# EAGLE design SDuino_ultramicroOLED_radio4 (EAGLE 7.6.0)
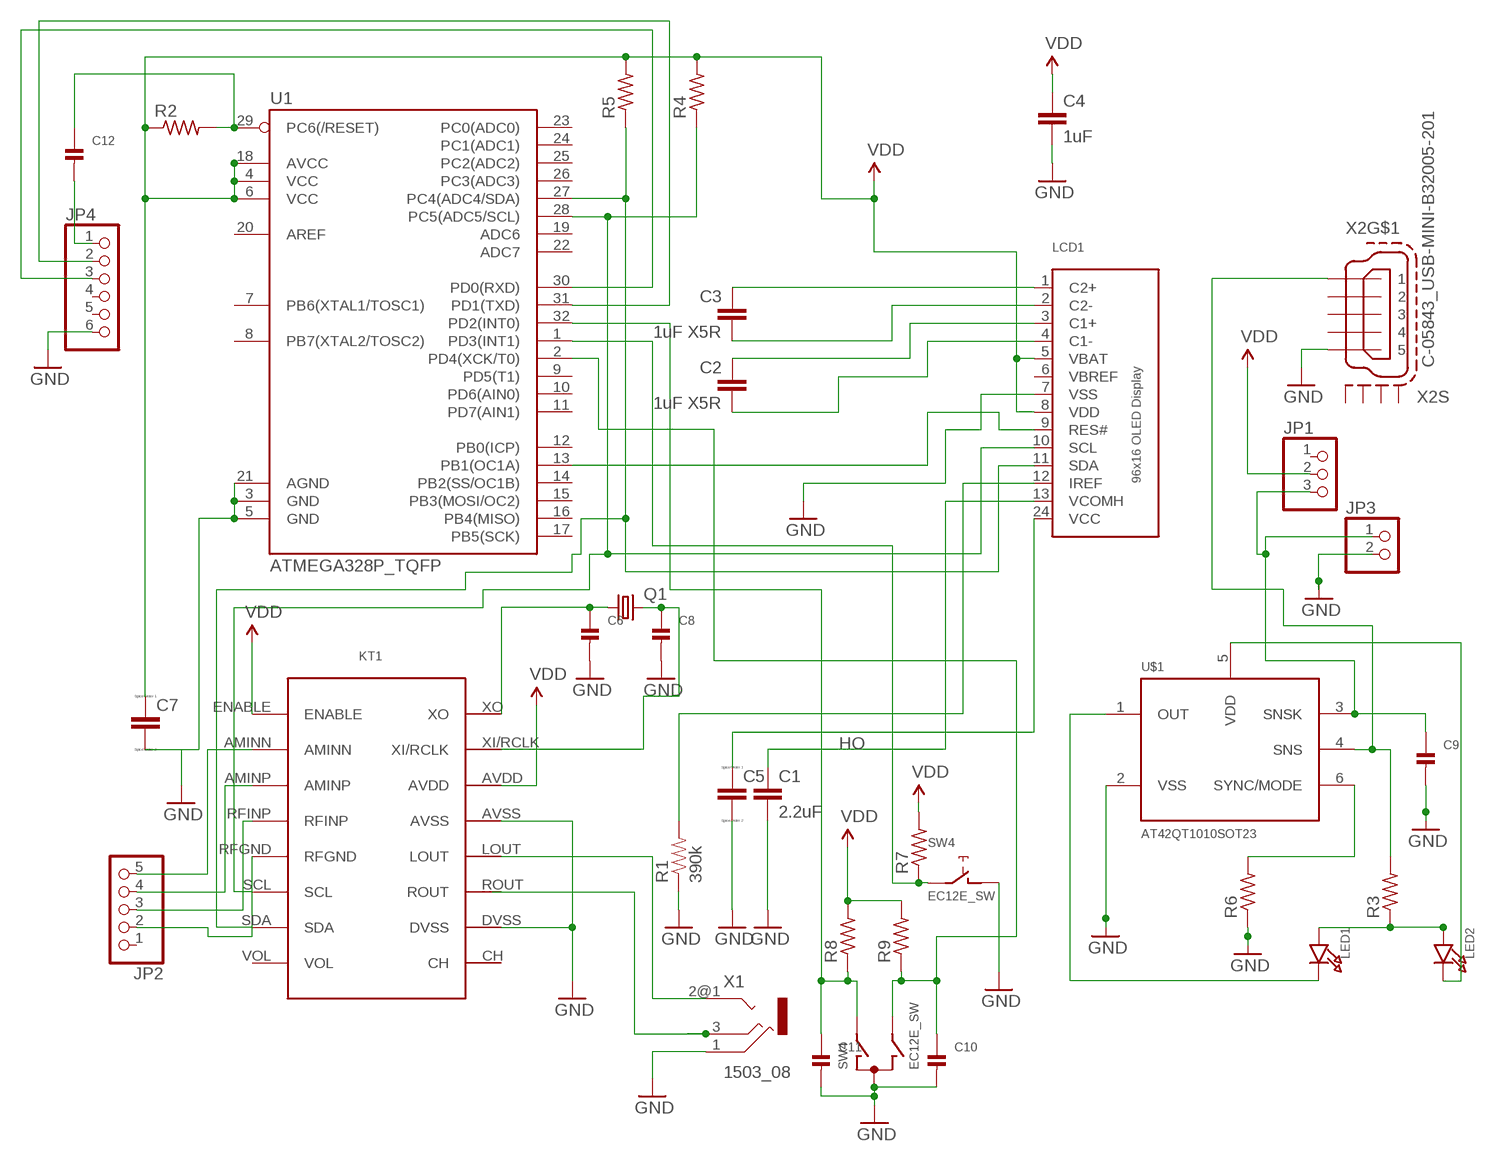
[diagram p0: schematic, sheet 1]

## Parts
C1  2.2uF  CAP0805  [0805]
C2  1uF X5R  CAP0805  [0805]
C3  1uF X5R  CAP0805  [0805]
C4  1uF  CAP0603-CAP  [0603-CAP]
C5  CC0603  [C0603]
C6  CAP_CERAMIC0603  [0603]
C7  CC0603  [C0603]
C8  CAP_CERAMIC0603  [0603]
C9  CAP_CERAMIC0603  [0603]
C10  CAP_CERAMIC0603  [0603]
C11  CAP_CERAMIC0603  [0603]
C12  CAP_CERAMIC0603  [0603]
JP1  HEADER-1X3  [1X03_OVAL]
JP2  HEADER-1X5  [1X05_OVAL]
JP3  HEADER-1X2  [1X02_OVAL]
JP4  HEADER-1X6  [1X06_OVAL]
KT1  KT0915  [KT0915]
LCD1  DISP_OLED_UG-9616GLBBG02  [UG-9616GLBBG02_0.65MM_WRAPAROUND]
LED1  LED0603  [CHIPLED_0603]
LED2  LED0603  [CHIPLED_0603]
Q1  CRYSTALTC26V  [TC26V]
R1  390k  RESISTOR0603-RES  [0603-RES]
R2  R-US_R0603  [R0603]
R3  R-US_R0603  [R0603]
R4  R-US_R0603  [R0603]
R5  R-US_R0603  [R0603]
R6  R-US_R0603  [R0603]
R7  R-US_R0603  [R0603]
R8  R-US_R0603  [R0603]
R9  R-US_R0603  [R0603]
SW4  EC12E_SW  [ALPS_EC12E_SW]
U1  ATMEGA328P_TQFP  [TQFP32-08]
U$1  AT42QT1010SOT23  [SOT23-6]
X1  1503_08  [1503_08]
X2  C-05843_USB-MINI-B32005-201  [32005-201]

## Nets
C1N: C2.2 LCD1.4(C1-)
C1P: C2.1 LCD1.3(C1+)
C2N: C3.2 LCD1.2(C2-)
C2P: C3.1 LCD1.1(C2+)
GND: C1.2 C4.2 C5.2 C6.2 C7.2 C8.2 C9.2 C10.2 C11.2 JP3.2 JP4.6 KT1.AVSS KT1.DVSS LCD1.7(VSS) R1.1 R6.1 SW4.C SW4.D U1.3(GND) U1.5(GND) U1.21(AGND) U$1.2(VSS) X1.1 X2.5
HO: C1.1 LCD1.13(VCOMH)
IREF: LCD1.12(IREF) R1.2
N$1: KT1.LOUT X1.2@1
N$2: C12.1 R2.2 U1.29(PC6(/RESET))
N$3: LCD1.9(RES#) U1.13(PB1(OC1A))
N$4: C6.1 KT1.XO Q1.1
N$5: C8.1 KT1.XI/RCLK Q1.2
N$6: KT1.SCL LCD1.10(SCL) R4.1 U1.28(PC5(ADC5/SCL))
N$7: KT1.ROUT X1.3
N$8: R3.2 U$1.4(SNS) X2.1
N$9: JP2.5 KT1.AMINN
N$10: KT1.SDA LCD1.11(SDA) R5.1 U1.27(PC4(ADC4/SDA))
N$11: JP2.4 KT1.AMINP
N$12: JP2.3 KT1.RFINP
N$13: JP2.2 KT1.RFGND
N$14: JP4.3 U1.30(PD0(RXD))
N$15: C11.1 R8.1 SW4.A U1.32(PD2(INT0))
N$16: C10.1 R9.1 SW4.B U1.2(PD4(XCK/T0))
N$17: LED1.A LED2.A R3.1
N$18: LED1.C U$1.1(OUT)
N$19: LED2.C U$1.5(VDD)
N$20: C9.1 JP1.3 JP3.1 U$1.3(SNSK)
N$21: R7.1 SW4.E U1.1(PD3(INT1))
N$22: R6.2 U$1.6(SYNC/MODE)
N$23: C12.2 JP4.1
N$24: JP4.2 U1.31(PD1(TXD))
VCOMH: C5.1 LCD1.24(VCC)
VDD: C4.1 C7.1 JP1.2 KT1.AVDD KT1.ENABLE LCD1.5(VBAT) LCD1.8(VDD) R2.1 R4.2 R5.2 R7.2 R8.2 R9.2 U1.4(VCC) U1.6(VCC) U1.18(AVCC)
Unconnected: JP1.1 JP2.1 JP4.4 JP4.5 KT1.CH KT1.VOL LCD1.6(VBREF) SW4.GND1(G) SW4.GND2(G) U1.7(PB6(XTAL1/TOSC1)) U1.8(PB7(XTAL2/TOSC2)) U1.9(PD5(T1)) U1.10(PD6(AIN0)) U1.11(PD7(AIN1)) U1.12(PB0(ICP)) U1.14(PB2(SS/OC1B)) U1.15(PB3(MOSI/OC2)) U1.16(PB4(MISO)) U1.17(PB5(SCK)) U1.19(ADC6) U1.20(AREF) U1.22(ADC7) U1.23(PC0(ADC0)) U1.24(PC1(ADC1)) U1.25(PC2(ADC2)) U1.26(PC3(ADC3)) X1.2@2 X2.2 X2.3 X2.4 X2.M1(S:S1) X2.M2(S:S2) X2.M3(S:S3) X2.M4(S:S4)

## Library data of the parts
C1-C4 = SparkFun-Passives:CAP: Capacitor Standard 0603 ceramic capacitor, and 0.1" leaded capacitor.
C5 C7 = eagle-ltspice:C: CAPACITOR, European symbol; SPICEMODEL: NONE; SPICEPREFIX: C
C6 C8-C12 = OLED_mod:CAP_CERAMIC: Ceramic Capacitors 0402 - 0402 Surface Mount Capacitors 16pF 50V 5% [Digikey: 445-4899-2-ND] 18pF 50V 5% [Digikey: 490-1281-2-ND] 22pF 50V 5% [Digikey: 490-1283-2-ND] 68pF 50V 5% [Digikey: 490-1289-2-ND] 0.1uF 10V 10% [Digikey: 490-1318-2-ND] 1.0uF 6.3V 10% [Digikey: 490-1320-2-ND] 0603 - 0603 Surface Mount Capacitors 16 pF 50V 5% [Digikey: 445-5051-2-ND] 22 pF 50V [Digikey: PCC220ACVTR-ND] 33 pF 50V 5% [Digikey: 490-1415-1-ND] 56pF 50V 5% [Digikey: 490-1421-1-ND] 220pF 50V 5% [Digikey: 445-1285-1-ND] 680 pF 50V 2200 pF 50V 5% C0G [Digikey: 445-1297-1-ND] 5600 pF 100V 5% X7R [Digikey: 478-3711-1-ND] 0.1 µF 25V 10% [Digikey: PCC2277TR-ND] 0.22 µF 16V 10% X7R [Digikey: 445-1318-1-ND] 1.0 µF 25V 10% [Digikey: 445-5146-2-ND] 0603 - RF Specific 3pF 250V +/-0.1pF RF [Digikey: 712-1347-1-ND] 18 pF 250V 5% [Digikey: 478-3505-1-ND or 712-1322-1-ND] 56 pF 250V 5% C0G RF [Digikey: 490-4867-1-ND] 68 pF 250V RF [Digikey: 490-4868-1-ND] 0805 - 0805 Surface Mount Capacitors 220 pF 250V 2% RF Ceramic Capacitor [Digikey: 712-1398-1-ND] 1000 pF 50V 2% NP0 Ceramic Capacitor [Digikey: 478-3760-1-ND] 0.1 µF 25V 10% Ceramic Capacitor [Digikey: PCC1828TR-ND] 1.0 µF 16V 10% Ceramic Capacitor[Digikey: 490-1691-2-ND] 10.0 µF 10V 10% Ceramic Capacitor[Digikey: 709-1228-1-ND] 10.0 uF 16V 10% Ceramic Capacitor [Digikey: 478-5165-2-ND] 47 uF 6.3V 20% Ceramic Capacitor [Digikey: 587-1779-1-ND or 399-5506-1-ND] 1206 - 1206 Surface Mount Capacitors 47uF 10V 20% Ceramic Capacitor [Digikey: 490-5528-1-ND or 399-5508-1-ND or 445-6010-1-ND] 100uF 6.3V -20%, +80% Y5V Ceramic Capacitor (Digikey: 490-4512-1-ND, Mouser: 81-GRM31CF50J107ZE1L)
JP1 = OLED_mod:HEADER-1X3: PIN HEADER
JP2 = OLED_mod:HEADER-1X5: PIN HEADER
JP3 = OLED_mod:HEADER-1X2: PIN HEADER
JP4 = OLED_mod:HEADER-1X6: PIN HEADER
KT1 = dp_devices:KT0915
LCD1 = OLED_mod:DISP_OLED_UG-9616GLBBG02: 96x16 0.84" I2C Mono OLED Display
LED1 LED2 = OLED_mod:LED: LED 0603 - 0603 Surface Mount Package 2mA: Green LED - Low Power (3.9mcd, 2ma, 1.7Vf) - Digikey: 475-2709-2-ND Orange LED - Low Power (9.8mcd, 2ma, 1.8Vf) - Digikey: 475-1194-2-ND Red LED - Low Power (5mcd, 2ma, 1.8Vf) - Digikey: 475-1195-2-ND Yellow LED - Low Power (7mcd, 2ma, 1.8Vf) - Digikey: 475-1196-2-ND 5mA: Blue LED - Low Power (17mcd, 5ma, 2.9Vf) - Digikey: LNJ937W8CRACT-ND 0805 - 0805 Surface Mount Package 2mA: Red LED (8.8mcd, 2mA, 1.8Vf, Clear) - Low Power [Digikey: 475-2510-1-ND] Green LED (5mcd, 2mA, 1.8Vf, Clear) - Low Power [Digikey: 475-2730-1-ND] Yellow LED (11.3mcd, 2mA, 1.8Vf, Clear) - Low Power [Digikey: 475-2555-1-ND] 20mA: Red LED (104mcd, 20mA, Diffused) - LS R976 [Digikey: 475-1278-6-ND] Red LED (12mcd, 20mA, 2.0Vf, Clear) - APT2012EC [Digikey: 754-1128-1-ND] Green LED (15mcd, 20mA, 2.2Vf, Clear) - APT2012GC [Digikey: 754-1131-1-ND] Orange LED (160mcd, 20mA, 2.1Vf, Clear) - APT2012SECK [Digikey: 754-1130-1-ND] 1206 - 1206 Surface Mount Package Green LED (26mcd, 20mA, Diffused) - LG N971 [Digikey: 475-1407-6-ND] Red LED (15mcd, 20mA, Diffused) - LH N974 [Digikey: 475-1416-6-ND]
Q1 = adafruit:CRYSTAL: CRYSTAL; OC_FARNELL: unknown; OC_NEWARK: unknown
R1 = SparkFun-Passives:RESISTOR: Resistor Basic schematic elements and footprints for 0603, 1206, and PTH resistors.
R2-R9 = resistor:R-US_: RESISTOR, American symbol
SW4 = switch-alps:EC12E_SW: ALPS rotary Encoder EC12E series with switch; MPN: EC12E2424407; OC_FARNELL: 1520813; OC_NEWARK: 74M1068
U1 = SparkFun-DigitalIC:ATMEGA328P_TQFP; PROD_ID: IC-09069
U$1 = SparkFun-DigitalIC:AT42QT1010
X1 = con-lumberg:1503_?: Jack connectors according to JISC 6560, 3.5 mm Klinkensteckverbinder nach JISC 6560, 3,5 mm Source: http://www.lumberg.com/Produkte/PDFs/1503_08.pdf; OC_FARNELL: unknown; OC_NEWARK: unknown
X2 = Akizuki:C-05843_USB-MINI-B: MINI USB-B Conector Source: www.cypressindustries.com; OC_FARNELL: unknown; OC_NEWARK: unknown

## Board
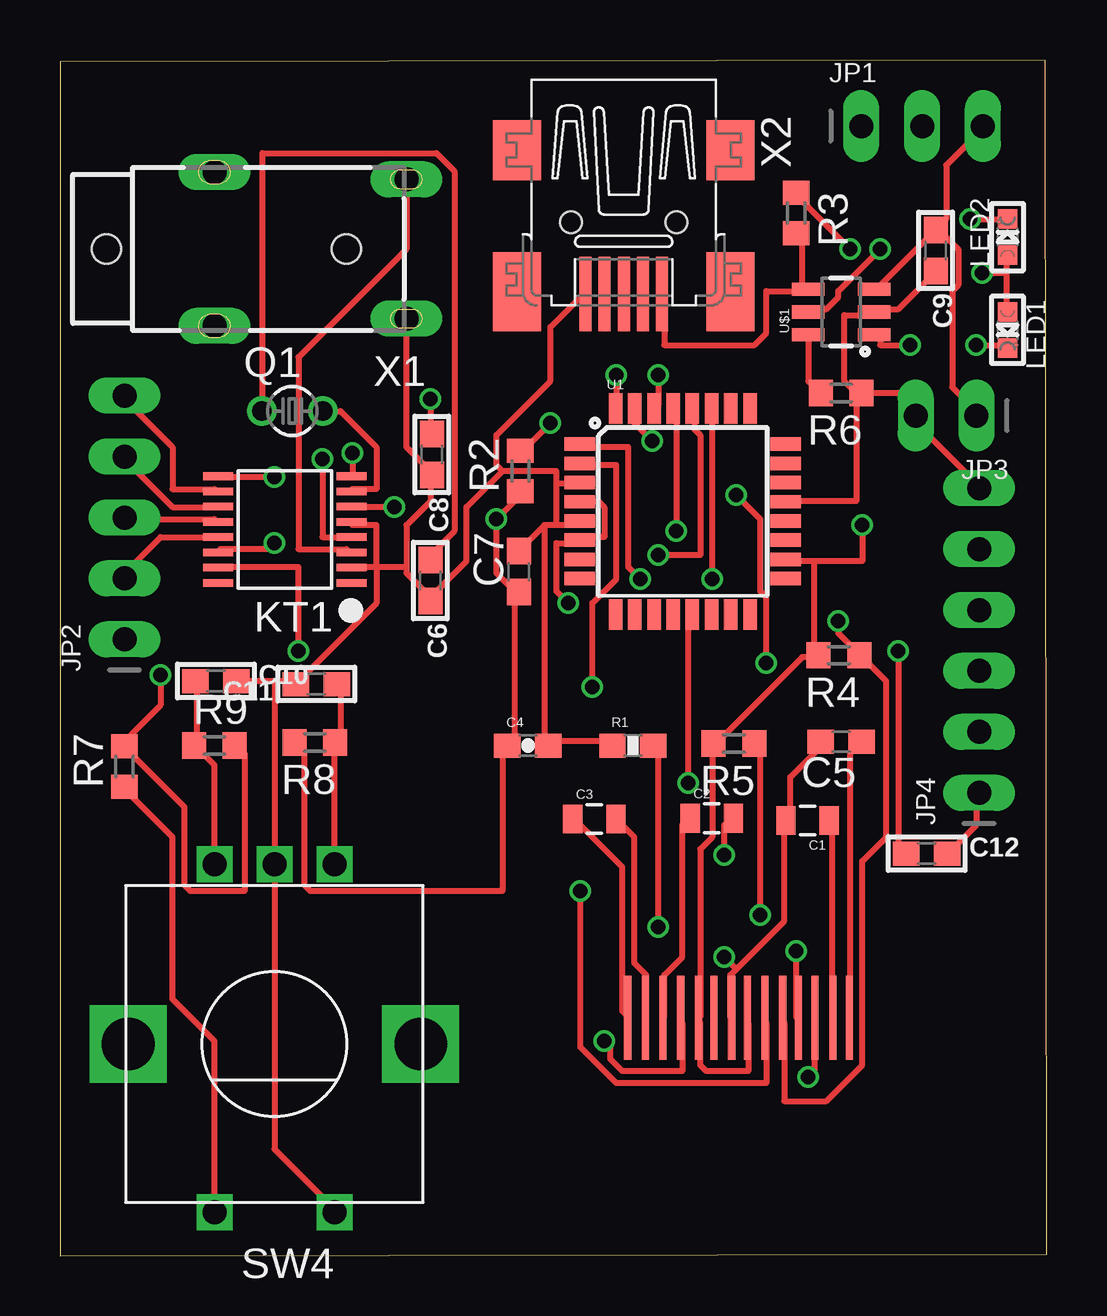
[diagram p1: board, top side]
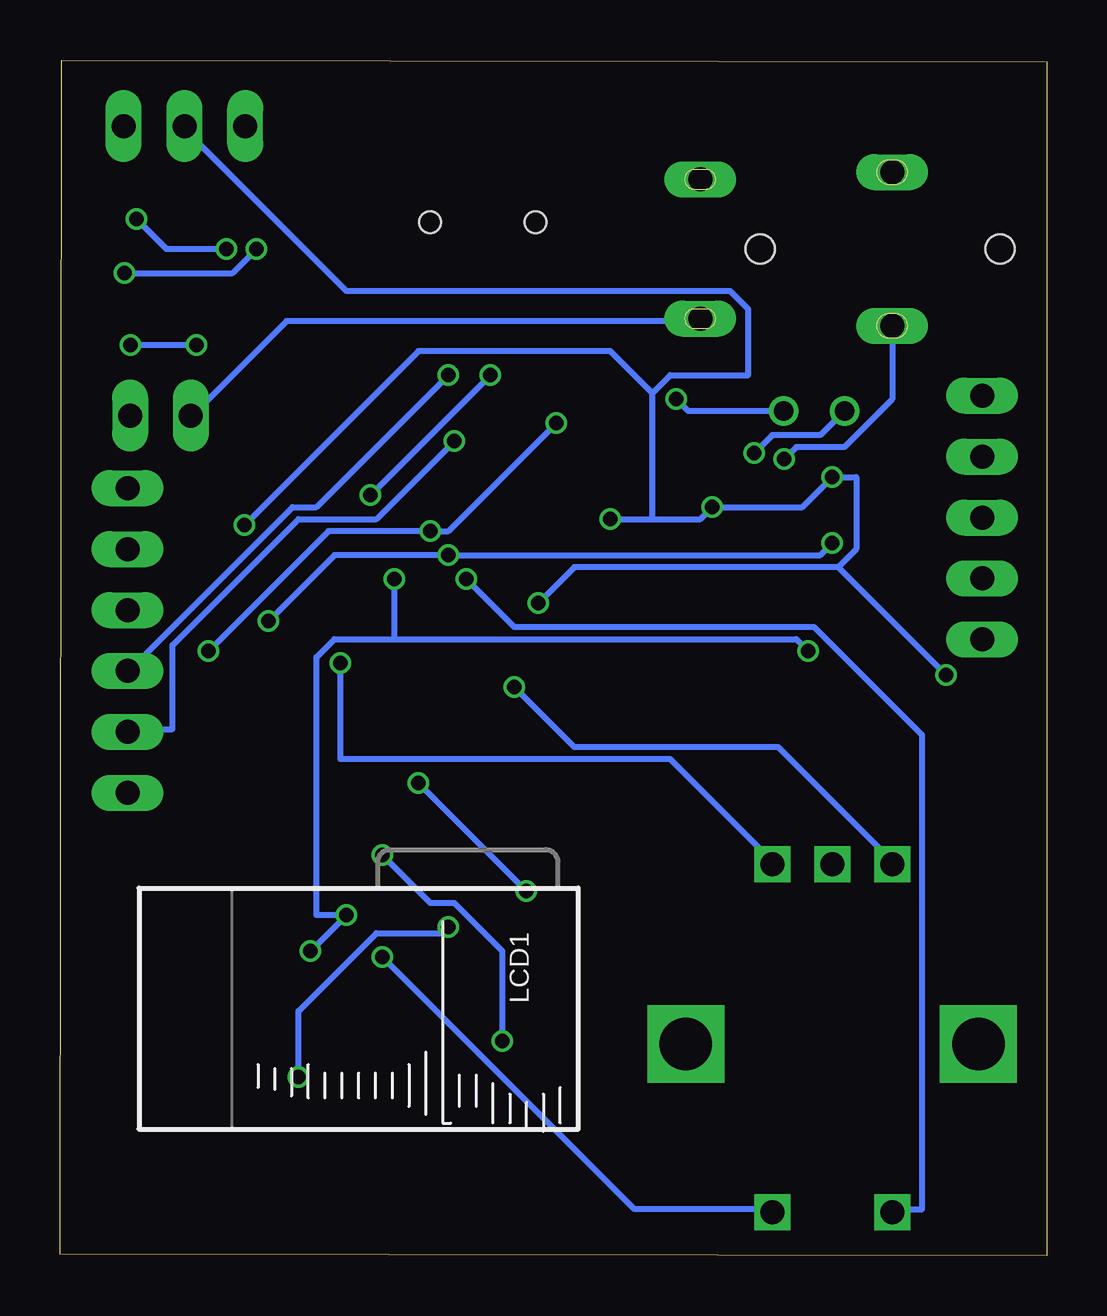
[diagram p2: board, bottom side, seen from below]

Size 41.12 x 49.81 mm. Coordinates in mm from the lower left corner, seen from the top.
Outline: 0,0 41.13,0.06 41.06,49.81 0,49.75 0,0
Copper layers (1*16): Top 0.035mm / dielectric 1.6mm / Bottom 0.035mm
Design rules "Elecrow_2-layer_PCB_eagle_rule": minimum track width 6mil, minimum drill 12mil, track to track 6mil, track to pad 6mil, pad to pad 6mil, via to via 8mil, smd to smd 0mil, copper to edge 20mil, drill to drill 10mil, minimum pad ring 6mil, minimum via ring 6mil, stop-mask expansion 0mil, vias tented up to drill 100mil, thermal gap 10mil

### Footprints (pad centres in the part's own frame; a part is rotated, then mirrored left to right if it is on the bottom)
0805 = smd 0.8 x 1.2: 1 -0.9,0; 2 0.9,0
0603-CAP = smd 1.1 x 1: 1 -0.85,0; 2 0.85,0
C0603 = smd 1.1 x 1: 1 -0.85,0; 2 0.85,0
0603 = smd 1.1 x 1: 1 -0.85,0; 2 0.85,0
1X03_OVAL = drill 1 long: 1 -2.54,0; 2 0,0; 3 2.54,0
1X05_OVAL = drill 1 long: 1 -5.08,0; 2 -2.54,0; 3 0,0; 4 2.54,0; 5 5.08,0
1X02_OVAL = drill 1 long: 1 -1.27,0; 2 1.27,0
1X06_OVAL = drill 1 long: 1 -6.35,0; 2 -3.81,0; 3 -1.27,0; 4 1.27,0; 5 3.81,0; 6 6.35,0
KT0915 = smd 0.32 x 1.26: AMINN 1.587,2.779; AMINP 0.952,2.779; AVDD 0.952,-2.779; AVSS 0.317,-2.779; CH -2.223,-2.779; DVSS -1.588,-2.779; ENABLE 2.222,2.779; LOUT -0.318,-2.779; RFGND -0.318,2.779; RFINP 0.317,2.779; ROUT -0.953,-2.779; SCL -0.953,2.779; SDA -1.588,2.779; VOL -2.223,2.779; XI/RCLK 1.587,-2.779; XO 2.222,-2.779
UG-9616GLBBG02_0.65MM_WRAPAROUND = smd 3.5 x 0.3 bottom: 1 -5.4,-0.463; 2 -5.4,0.275; 3 -5.4,1.012; 4 -5.4,1.75; 5 -5.4,2.487; 6 -5.4,3.138; 7 -5.4,3.875; 8 -5.4,4.525; 9 -5.4,5.263; 10 -5.4,6; 11 -5.4,6.65; 12 -5.4,7.338; 13 -5.4,8.088; 24 -5.4,8.775
CHIPLED_0603 = smd 0.8 x 0.8: A 0,-0.75; C 0,0.75
TC26V = drill 0.813: 1 -1.27,0; 2 1.27,0
0603-RES = smd 1.1 x 1: 1 -0.85,0; 2 0.85,0
R0603 = smd 1 x 1.1: 1 -0.85,0; 2 0.85,0
ALPS_EC12E_SW = drill 1 square: A -2.5,-7.5; B 2.5,-7.5; C 0,-7.5; D -2.5,7; E 2.5,7 | drill 2.2 square: GND1 -6.1,0; GND2 6.1,0
TQFP32-08 = smd 1.27 x 0.559: 1 -4.293,2.8; 2 -4.293,2; 3 -4.293,1.2; 4 -4.293,0.4; 5 -4.293,-0.4; 6 -4.293,-1.2; 7 -4.293,-2; 8 -4.293,-2.8; 17 4.293,-2.8; 18 4.293,-2; 19 4.293,-1.2; 20 4.293,-0.4; 21 4.293,0.4; 22 4.293,1.2; 23 4.293,2; 24 4.293,2.8 | smd 0.559 x 1.27: 9 -2.8,-4.293; 10 -2,-4.293; 11 -1.2,-4.293; 12 -0.4,-4.293; 13 0.4,-4.293; 14 1.2,-4.293; 15 2,-4.293; 16 2.8,-4.293; 25 2.8,4.293; 26 2,4.293; 27 1.2,4.293; 28 0.4,4.293; 29 -0.4,4.293; 30 -1.2,4.293; 31 -2,4.293; 32 -2.8,4.293
SOT23-6 = smd 0.55 x 1.35: 1 -0.95,-1.375; 2 0,-1.375; 3 0.95,-1.375; 4 0.95,1.375; 5 0,1.375; 6 -0.95,1.375
1503_08 = drill 1 pad 1.2 long: 1 -2.9,-8; 2@1 -3.2,0; 2@2 3.2,0; 3 2.9,-8 | hole 1.2: 0,4.5; 0,-5.5
32005-201 = smd 3.1 x 0.5: 1 3,1.6; 2 3,0.8; 3 3,0; 4 3,-0.8; 5 3,-1.6 | smd 2.5 x 2: M1 -3,-4.45; M2 -3,4.45 | smd 3.3 x 2: M3 2.9,4.45; M4 2.9,-4.45 | hole 0.9: 0,2.2; 0,-2.2

### Placement (x,y rotation side)
C1  31.16,18.13 180 top
C2  27.17,18.21 0 top
C3  22.27,18.19 0 top
C4  19.5,21.25 0 top
C5  32.56,21.41 180 top
C6  15.44,28.12 270 top
C7  19.13,28.5 90 top
C8  15.5,33.38 270 top
C9  36.5,41.88 270 top
C10  6.5,23.94 0 top
C11  10.69,23.81 180 top
C12  36.12,16.75 0 top
JP1  35.94,47.06 0 top
JP2  2.69,30.75 90 top
JP3  36.94,35 180 top
JP4  38.31,25.62 90 top
KT1  9.38,30.25 90 top
LCD1  24.12,15.31 90 bottom
LED1  39.5,38.56 180 top
LED2  39.5,42.44 0 top
Q1  9.69,35.19 0 top
R1  23.88,21.25 0 top
R2  19.19,32.69 90 top
R3  30.69,43.44 270 top
R4  32.47,25.01 180 top
R5  28.09,21.33 180 top
R6  32.56,35.94 180 top
R7  2.69,20.38 90 top
R8  10.62,21.38 180 top
R9  6.44,21.25 0 top
SW4  8.94,8.81 180 top
U1  25.96,31 0 top
U$1  32.56,39.31 90 top
X1  6.44,41.94 90 top
X2  23.5,43.06 270 top

### Tracks (layer width: path | path; a pad name or v marks a point on that pad's centre or on a via)
C1N  (via drill 0.61)
  Top 0.254: v27.69,16.69 27.69,17.94 27.94,18.19 C2.2 | v22.69,8.94 22.94,8.69 22.94,8.19 23.44,7.69 25.94,7.69 25.94,9.69 LCD1.4
  Bottom 0.254: v27.69,16.69 25.69,14.69 24.69,14.69 22.69,12.69 v22.69,8.94
C1P
  Top 0.254: C2.1 26.19,18.19 25.94,17.94 25.94,12.44 25.19,11.69 25.19,9.94 LCD1.3
C2N
  Top 0.254: C3.2 23.94,17.44 23.94,12.19 24.44,11.69 24.44,9.94 LCD1.2
C2P
  Top 0.254: C3.1 21.44,18.19 23.44,16.19 23.44,10.19 23.69,9.94 LCD1.1
GND  (via drill 0.61)
  Top 0.254: R1.1 22.94,21.44 20.44,21.44 C4.2 20.19,21.44 20.19,30.44 | 20.19,30.44 19.19,29.44 C7.2 | 20.69,30.44 21.44,30.44 U1.5 | 20.69,30.44 20.19,30.44 | 20.69,32.19 21.44,32.19 U1.3 | 20.69,30.44 20.69,32.19 | 18.44,32.69 18.19,32.94 18.19,34.19 20.44,36.44 20.44,38.69 21.69,39.94 X2.5 | 18.44,32.69 20.69,32.69 20.69,32.19 | C9.2 36.44,40.94 34.94,39.44 34.19,39.44 U$1.2 33.94,39.19 32.69,39.19 32.69,36.44 33.19,35.94 | 33.19,35.94 33.19,31.44 30.44,31.44 U1.21 | 33.19,35.94 R6.1 35.44,35.94 35.44,35.19 JP3.2 35.69,34.94 35.69,34.69 38.19,32.19 JP4.6 | C5.2 31.69,21.19 30.44,19.94 30.44,18.19 C1.2 30.19,17.94 30.19,13.94 28.19,11.94 | 28.19,11.94 27.94,11.69 27.94,9.94 LCD1.7 | 8.94,23.94 9.69,23.94 C11.2 9.94,23.94 13.19,27.19 13.19,28.69 | 8.94,23.94 C10.2 | 15.44,27.44 14.44,28.44 14.44,28.69 | 14.44,28.69 14.44,30.44 15.44,31.44 15.44,32.44 C8.2 15.44,32.69 14.44,33.69 X1.1 | 14.44,28.69 13.19,28.69 | 13.19,28.69 12.19,28.69 KT1.DVSS | 13.19,28.69 13.19,30.44 12.19,30.44 KT1.AVSS | 8.94,23.94 SW4.C 8.94,4.44 11.44,1.94 SW4.D | v27.69,12.44 28.19,11.94 | 18.44,32.69 16.94,31.19 16.94,28.94 15.44,27.44 | 15.44,27.44 C6.2
  Bottom 0.254: v27.69,12.44 17.19,1.94 11.44,1.94 SW4.D | JP3.2 35.44,35.19 31.69,38.94 14.44,38.94 X1.1
HO
  Top 0.254: C1.1 32.19,17.94 32.19,9.94 LCD1.13
IREF  (via drill 0.61)
  Top 0.254: v24.94,13.69 24.94,21.19 R1.2 | v31.19,7.44 31.44,7.69 31.44,9.69 LCD1.12
  Bottom 0.254: v24.94,13.69 25.19,13.44 27.94,13.44 31.19,10.19 v31.19,7.44
N$1  (via drill 0.61)
  Top 0.254: v10.94,33.19 10.94,29.94 11.94,29.94 KT1.LOUT
  Bottom 0.254: v10.94,33.19 10.44,33.69 8.44,33.69 6.44,35.69 X1.2@1
N$2  (via drill 0.61)
  Top 0.254: v34.94,25.19 34.94,17.19 35.19,16.94 C12.1 | v25.69,30.19 25.69,35.19 U1.29 | v20.44,34.69 19.44,33.69 R2.2
  Bottom 0.254: v34.94,25.19 29.94,30.19 v25.69,30.19 24.94,30.19 v20.44,34.69
N$3  (via drill 0.61)
  Top 0.254: v26.19,19.69 26.19,26.69 U1.13 | v21.69,15.19 21.69,8.69 23.19,7.19 29.44,7.19 29.44,9.69 LCD1.9
  Bottom 0.254: v21.69,15.19 v26.19,19.69
N$4  (via drill 0.61)
  Top 0.254: C6.1 15.44,29.19 16.44,30.19 16.44,45.19 15.69,45.94 8.44,45.94 8.44,35.19 Q1.1 | v12.19,33.44 12.19,32.44 KT1.XO
  Bottom 0.254: v12.19,33.44 11.44,34.19 9.44,34.19 8.44,35.19 Q1.1
N$5  (via drill 0.61)
  Top 0.254: v15.44,35.69 15.44,34.44 C8.1 | Q1.2 11.69,35.19 13.19,33.69 13.19,31.94 12.19,31.94 KT1.XI/RCLK
  Bottom 0.254: v15.44,35.69 14.94,35.19 Q1.2
N$6  (via drill 0.61)
  Top 0.254: LCD1.10 30.19,9.69 30.19,6.44 31.94,6.44 33.44,7.94 33.44,16.44 34.44,17.44 34.44,23.94 33.44,24.94 R4.1 33.19,25.19 32.44,25.94 v32.44,26.44 | v8.94,29.69 8.94,29.44 6.69,29.44 KT1.SCL | v24.94,29.19 26.69,29.19 26.69,34.19 26.44,34.44 26.44,35.19 U1.28
  Bottom 0.254: v8.94,29.69 9.44,29.19 v24.94,29.19 29.69,29.19 v32.44,26.44
N$7
  Top 0.254: X1.3 14.44,41.94 9.94,37.44 9.94,29.44 11.94,29.44 KT1.ROUT
N$8
  Top 0.254: R3.2 30.69,42.44 30.94,42.19 30.94,40.44 U$1.4 30.94,40.19 29.44,40.19 29.44,38.44 28.94,37.94 25.19,37.94 25.19,39.94 X2.1
N$9
  Top 0.254: KT1.AMINN 6.44,31.94 4.69,31.94 4.69,33.69 2.69,35.69 JP2.5
N$10  (via drill 0.61)
  Top 0.254: v29.19,14.19 29.19,21.19 R5.1 | v30.69,12.69 30.69,9.94 LCD1.11 | v9.94,25.19 9.94,28.69 6.69,28.69 KT1.SDA | v27.19,28.19 27.19,35.19 U1.27
  Bottom 0.254: v30.69,12.69 v29.19,14.19 30.44,14.19 30.44,24.94 29.69,25.69 27.19,25.69 | v9.94,25.19 10.44,25.69 27.19,25.69 | 27.19,25.69 v27.19,28.19
N$11
  Top 0.254: KT1.AMINP 6.44,31.19 4.69,31.19 2.69,33.19 JP2.4
N$12
  Top 0.254: KT1.RFINP 6.44,30.69 2.69,30.69 JP2.3
N$13
  Top 0.254: KT1.RFGND 6.44,29.94 4.19,29.94 2.69,28.44 JP2.2
N$14  (via drill 0.61)
  Top 0.254: v24.94,36.69 24.94,35.44 U1.30
  Bottom 0.254: v24.94,36.69 30.44,31.19 31.44,31.19 38.19,24.44 JP4.3
N$15  (via drill 0.61)
  Top 0.254: C11.1 11.69,23.69 11.69,21.44 R8.1 11.44,21.19 SW4.A | v23.19,36.69 23.19,35.44 U1.32 | v28.19,31.69 29.19,30.69 29.19,27.69 29.44,27.44 v29.44,24.69
  Bottom 0.254: v28.19,31.69 v23.19,36.69 | v29.44,24.69 29.44,20.69 15.69,20.69 11.44,16.44 SW4.A
N$16  (via drill 0.61)
  Top 0.254: C10.1 5.69,23.94 5.69,21.44 R9.1 5.69,21.19 6.44,20.44 SW4.B | v22.19,23.69 22.19,27.19 23.19,28.19 23.19,32.94 21.69,32.94 U1.2
  Bottom 0.254: v22.19,23.69 19.69,21.19 11.19,21.19 6.44,16.44 SW4.B
N$17  (via drill 0.61)
  Top 0.254: 39.44,40.94 39.44,41.69 LED2.A | 39.44,40.94 39.44,39.44 LED1.A | v32.94,41.94 30.69,44.19 R3.1 | 39.44,40.94 v38.44,40.94
  Bottom 0.254: v32.94,41.94 33.94,40.94 v38.44,40.94
N$18  (via drill 0.61)
  Top 0.254: v38.19,37.94 39.44,37.94 LED1.C | v35.44,37.94 34.19,37.94 34.19,38.19 U$1.1
  Bottom 0.254: v35.44,37.94 v38.19,37.94
N$19  (via drill 0.61)
  Top 0.254: v37.94,43.19 LED2.C | v34.19,41.94 32.44,40.19 32.44,39.94 31.94,39.44 31.19,39.44 U$1.5
  Bottom 0.254: v37.94,43.19 36.69,41.94 v34.19,41.94
N$20
  Top 0.254: C9.1 36.44,42.69 34.19,40.44 U$1.3 | C9.1 36.69,42.94 36.94,43.19 36.94,45.44 38.44,46.94 JP1.3 | JP3.1 38.19,35.19 37.19,36.19 37.19,40.19 37.44,40.44 37.44,41.94 36.69,42.69 C9.1
N$21  (via drill 0.61)
  Top 0.254: SW4.E 6.44,8.94 4.69,10.69 4.69,17.44 2.69,19.44 R7.1 | v24.19,28.19 23.69,28.69 23.69,33.69 21.69,33.69 U1.1
  Bottom 0.254: v24.19,28.19 22.19,26.19 9.69,26.19 5.19,21.69 5.19,1.94 6.44,1.94 SW4.E
N$22
  Top 0.254: R6.2 31.69,35.94 31.19,36.44 31.19,38.19 U$1.6
N$23
  Top 0.254: C12.2 37.19,16.94 38.19,17.94 38.19,19.19 JP4.1
N$24  (via drill 0.61)
  Top 0.254: v24.69,33.94 23.94,34.69 23.94,35.19 U1.31
  Bottom 0.254: v24.69,33.94 27.94,30.69 31.19,30.69 36.44,25.44 36.44,21.94 38.19,21.94 JP4.2
VCOMH
  Top 0.254: C5.1 32.94,20.94 32.94,9.94 LCD1.24
VDD  (via drill 0.61)
  Top 0.254: LCD1.8 28.69,9.69 28.69,7.69 26.94,7.69 26.69,7.94 26.69,9.69 LCD1.5 26.69,9.94 26.69,16.94 27.19,17.44 27.19,21.19 R5.2 27.44,21.44 30.94,24.94 31.44,24.94 R4.2 31.44,25.19 31.44,28.94 | 31.44,28.94 30.44,28.94 U1.18 | R9.2 7.44,21.19 7.69,20.94 7.69,15.19 5.44,15.19 5.19,15.44 5.19,18.69 2.69,21.19 R7.2 2.69,21.44 4.19,22.94 v4.19,24.19 | U1.4 21.69,31.44 22.44,31.44 22.69,31.19 22.69,29.94 21.69,29.94 U1.6 21.44,29.69 20.69,29.69 20.69,27.69 v21.19,27.19 | R8.2 9.94,21.19 10.19,20.94 10.19,15.44 10.44,15.19 18.44,15.19 18.44,21.19 C4.1 18.69,21.44 18.94,21.69 18.94,27.44 C7.1 18.94,27.69 18.19,28.44 v18.19,30.69 19.19,31.69 R2.1 | v13.94,31.19 12.19,31.19 KT1.AVDD | v8.94,32.44 6.69,32.44 KT1.ENABLE | 31.44,28.94 33.44,28.94 v33.44,30.44
  Bottom 0.254: v18.19,30.69 16.44,30.69 | 16.44,30.69 14.44,30.69 v13.94,31.19 10.19,31.19 v8.94,32.44 7.94,32.44 7.94,29.44 8.69,28.69 | v21.19,27.19 19.69,28.69 8.69,28.69 | 16.44,35.94 15.69,36.69 12.44,36.69 12.44,39.44 13.19,40.19 29.19,40.19 35.94,46.94 JP1.2 | 16.44,30.69 16.44,35.94 | 8.69,28.69 v4.19,24.19 | v33.44,30.44 26.19,37.69 18.19,37.69 16.44,35.94